# EAGLE design stlink-v3-hwmod (EAGLE 9.5.2)
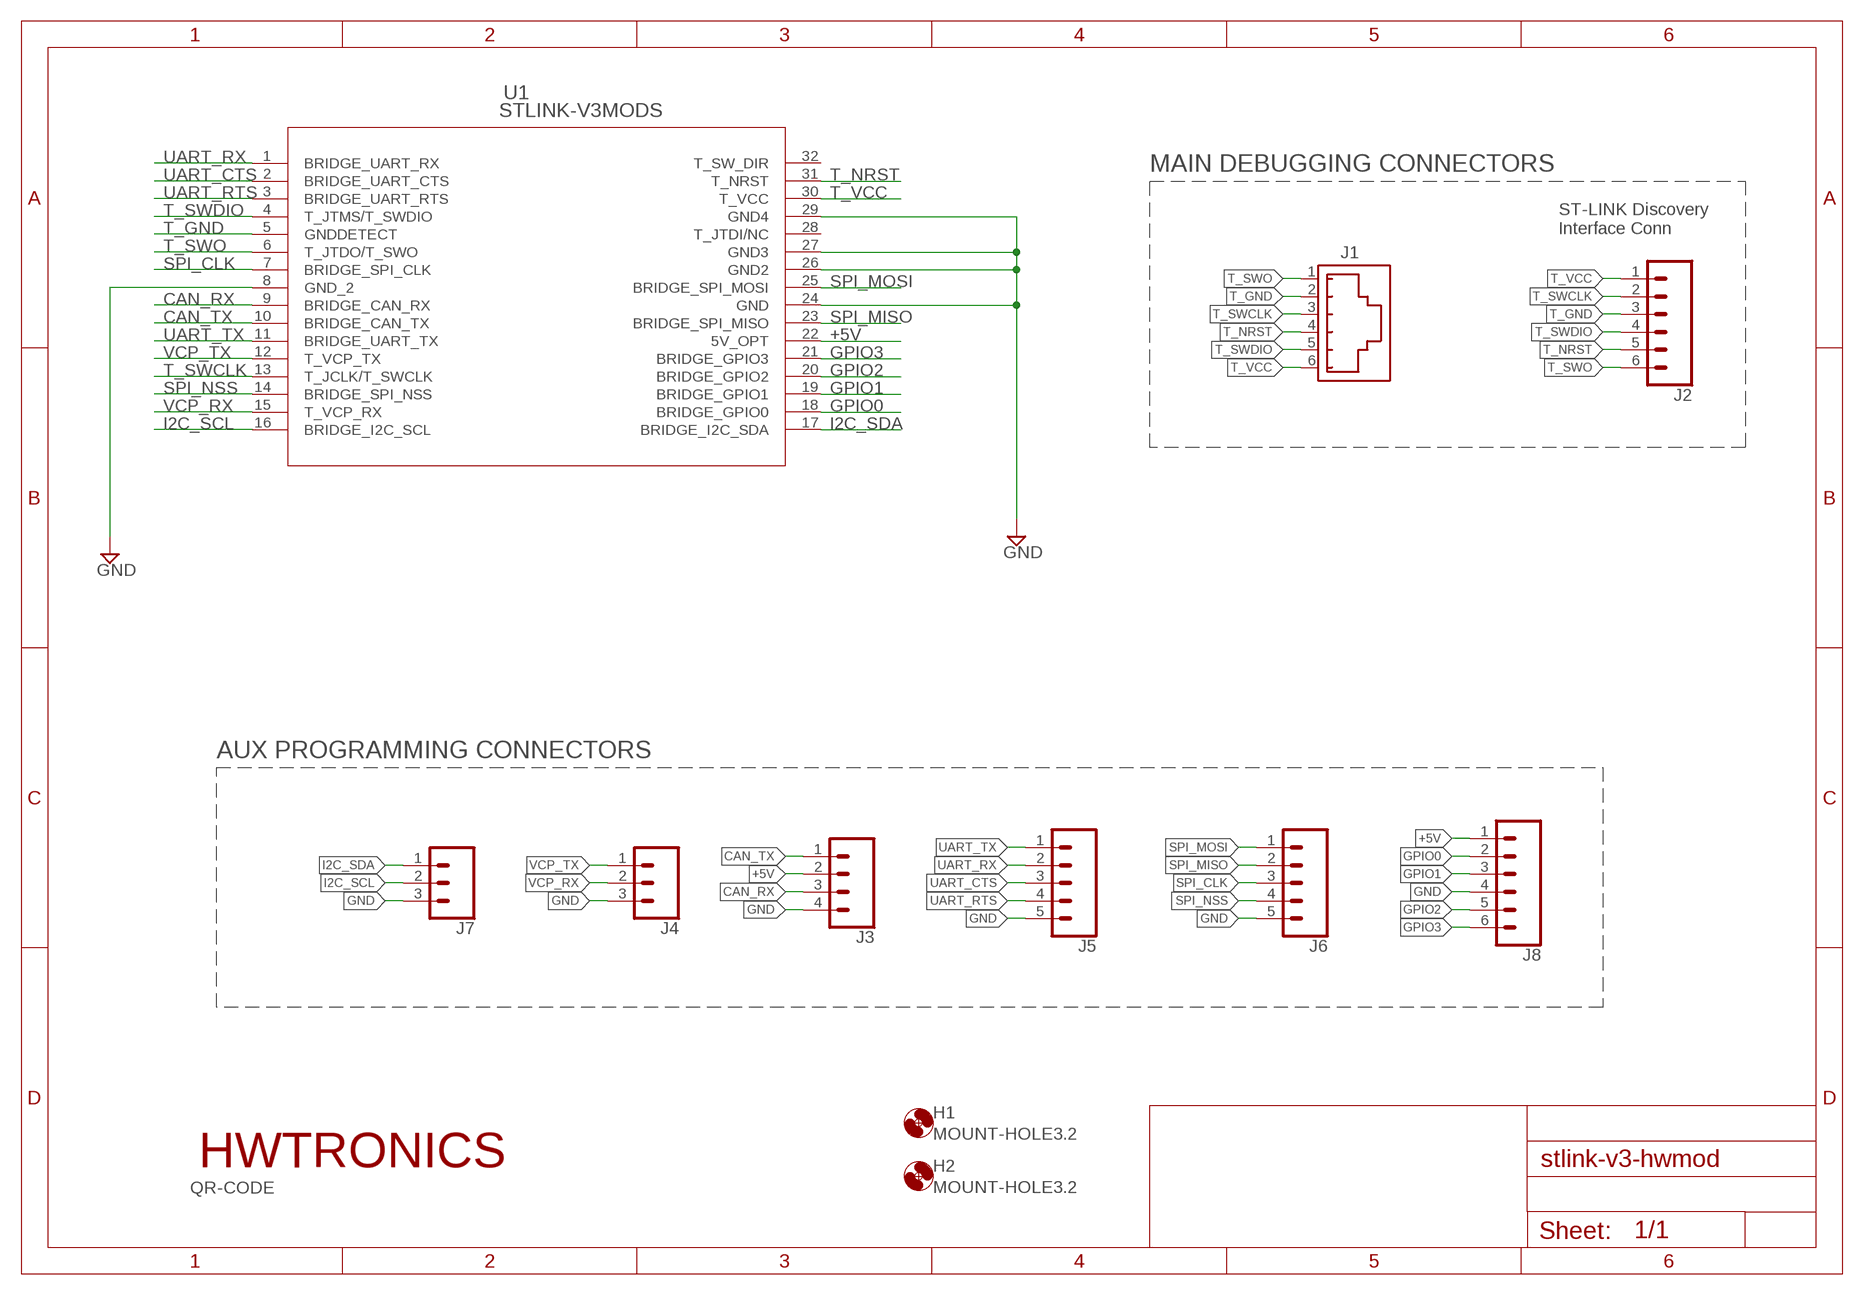
[diagram p0: schematic, sheet 1]

## Parts
H1  MOUNT-HOLE3.2  [3,2]
H2  MOUNT-HOLE3.2  [3,2]
J1  615006143621  [615006143621]
J2  CONN_06SILK_FEMALE_PTH  [1X06]
J3  CONN_04  [1X04]
J4  CONN_03  [1X03]
J5  CONN_05  [1X05]
J6  CONN_05  [1X05]
J7  CONN_03  [1X03]
J8  CONN_06SILK_FEMALE_PTH  [1X06]
LOGO1  LOGO-HWTRONICS-10MM  [HWTRONICS-10MM]
U1  STLINK-V3MODS  [MOD_STLINK-V3M_MB1467]
U$1  STLINK-V3-HWMODS  [STLINK-V3-HWMODS]

## Nets
+5V: J3.2 J8.1 U1.22(5V_OPT)
CAN_RX: J3.3 U1.9(BRIDGE_CAN_RX)
CAN_TX: J3.1 U1.10(BRIDGE_CAN_TX)
GND: J3.4 J4.3 J5.5 J6.5 J7.3 J8.4 U1.8(GND_2) U1.24(GND) U1.26(GND2) U1.27(GND3) U1.29(GND4)
GPIO0: J8.2 U1.18(BRIDGE_GPIO0)
GPIO1: J8.3 U1.19(BRIDGE_GPIO1)
GPIO2: J8.5 U1.20(BRIDGE_GPIO2)
GPIO3: J8.6 U1.21(BRIDGE_GPIO3)
I2C_SCL: J7.2 U1.16(BRIDGE_I2C_SCL)
I2C_SDA: J7.1 U1.17(BRIDGE_I2C_SDA)
SPI_CLK: J6.3 U1.7(BRIDGE_SPI_CLK)
SPI_MISO: J6.2 U1.23(BRIDGE_SPI_MISO)
SPI_MOSI: J6.1 U1.25(BRIDGE_SPI_MOSI)
SPI_NSS: J6.4 U1.14(BRIDGE_SPI_NSS)
T_GND: J1.2 J2.3 U1.5(GNDDETECT)
T_NRST: J1.4 J2.5 U1.31(T_NRST)
T_SWCLK: J1.3 J2.2 U1.13(T_JCLK/T_SWCLK)
T_SWDIO: J1.5 J2.4 U1.4(T_JTMS/T_SWDIO)
T_SWO: J1.1 J2.6 U1.6(T_JTDO/T_SWO)
T_VCC: J1.6 J2.1 U1.30(T_VCC)
UART_CTS: J5.3 U1.2(BRIDGE_UART_CTS)
UART_RTS: J5.4 U1.3(BRIDGE_UART_RTS)
UART_RX: J5.2 U1.1(BRIDGE_UART_RX)
UART_TX: J5.1 U1.11(BRIDGE_UART_TX)
VCP_RX: J4.2 U1.15(T_VCP_RX)
VCP_TX: J4.1 U1.12(T_VCP_TX)
Unconnected: U1.28(T_JTDI/NC) U1.32(T_SW_DIR)

## Notes on the sheet
- MAIN DEBUGGING CONNECTORS
- ST-LINK Discovery
  Interface Conn
- AUX PROGRAMMING CONNECTORS

## Library data of the parts
H1 H2 = holes:MOUNT-HOLE: MOUNTING HOLE with drill center marker
J1 = 615002138421_Eagle_WR-MJ_rev20a:615006143621: WR-MJ Modular Jack Horizontal Plastic 6P6C Tab Down KIND PROPERTIES Quality Class:500 Mating cycles General Information Operating Temperature:-40 up to +85 °C Compliance: RoHS Electrical Properties IR 1:1.5A Working Voltage:120V (AC) Withstanding Voltage:1000V (AC) Contact Resistance:20mΩ RISO:500 MΩ Material Properties Insulator MateriaL:PBT Insulator Flammability Rating:UL94 V-0 Color:Black Contact Material Copper Alloy Contact Plating:Selective Gold Contact Type:Stamped Packaging Properties Packaging:Tray <https://www.we-online.com/catalog/media/o33121v209%20Family_WR-MJ_THT_6P6C_61500X143621.jpg> Details see: https://www.we-online.com/catalog/en/MJ_HORIZONTAL_PLASTIC_6P6C_TAB_DOWN/? Updated by Yingchun,Shan 2020-01-06 2020 (C) Würth Elektronik; DATASHEET-URL: https://www.we-online.com/catalog/datasheet/615006143621.pdf; MOUNT: THT; PART-NUMBER: 615006143621; TYPE: Horizontal; XPXC: 6P6C
J2 J8 = SparkFun-Connectors:CONN_06: Multi connection point. Often used as Generic Header-pin footprint for 0.1 inch spaced/style header connections On any of the 0.1 inch spaced packages, you can populate with these: Break Away Headers - Straight <https://www.sparkfun.com/products/116> (PRT-00116) Break Away Male Headers - Right Angle <https://www.sparkfun.com/products/553> (PRT-00553) Female Headers <https://www.sparkfun.com/products/115> (PRT-00115) Break Away Headers - Machine Pin <https://www.sparkfun.com/products/117> (PRT-00117) Break Away Female Headers - Swiss Machine Pin <https://www.sparkfun.com/products/743> (PRT-00743) Arduino Stackable Header - 6 Pin <https://www.sparkfun.com/products/9280> (PRT-09280) For SCREWTERMINALS and SPRING TERMINALS visit here: Screw Terimnals on SparkFun.com <https://www.sparkfun.com/search/results?term=Screw+Terminals> (5mm/3.5mm/2.54mm spacing) This device is also useful as a general connection point to wire up your design to another part of your project. Our various solder wires solder well into these plated through hole pads. Hook-Up Wire - Assortment (Stranded, 22 AWG) <https://www.sparkfun.com/products/11375> (PRT-11375) Hook-Up Wire - Assortment (Solid Core, 22 AWG) <https://www.sparkfun.com/products/11367> (PRT-11367) View the entire wire category on our website here <https://www.sparkfun.com/categories/141>; PROD_ID: CONN-08437
J3 = SparkFun-Connectors:CONN_04: Multi connection point. Often used as Generic Header-pin footprint for 0.1 inch spaced/style header connections On any of the 0.1 inch spaced packages, you can populate with these: Break Away Headers - Straight <https://www.sparkfun.com/products/116> (PRT-00116) Break Away Male Headers - Right Angle <https://www.sparkfun.com/products/553> (PRT-00553) Female Headers <https://www.sparkfun.com/products/115> (PRT-00115) Break Away Headers - Machine Pin <https://www.sparkfun.com/products/117> (PRT-00117) Break Away Female Headers - Swiss Machine Pin <https://www.sparkfun.com/products/743> (PRT-00743) For SCREWTERMINALS and SPRING TERMINALS visit here: Screw Terimnals on SparkFun.com <https://www.sparkfun.com/search/results?term=Screw+Terminals> (5mm/3.5mm/2.54mm spacing) This device is also useful as a general connection point to wire up your design to another part of your project. Our various solder wires solder well into these plated through hole pads. Hook-Up Wire - Assortment (Stranded, 22 AWG) <https://www.sparkfun.com/products/11375> (PRT-11375) Hook-Up Wire - Assortment (Solid Core, 22 AWG) <https://www.sparkfun.com/products/11367> (PRT-11367) View the entire wire category on our website here <https://www.sparkfun.com/categories/141> Special notes: Molex polarized connector foot print use with SKU : PRT-08231 with associated crimp pins and housings. 1MM SMD Version SKU: PRT-10208; PROD_ID: CONN-09696
J4 J7 = SparkFun-Connectors:CONN_03: Multi connection point. Often used as Generic Header-pin footprint for 0.1 inch spaced/style header connections On any of the 0.1 inch spaced packages, you can populate with these: Break Away Headers - Straight <https://www.sparkfun.com/products/116> (PRT-00116) Break Away Male Headers - Right Angle <https://www.sparkfun.com/products/553> (PRT-00553) Female Headers <https://www.sparkfun.com/products/115> (PRT-00115) Break Away Headers - Machine Pin <https://www.sparkfun.com/products/117> (PRT-00117) Break Away Female Headers - Swiss Machine Pin <https://www.sparkfun.com/products/743> (PRT-00743) Stackable Header - 3 Pin (Female, 0.1") <https://www.sparkfun.com/products/13875> (PRT-13875) For SCREWTERMINALS and SPRING TERMINALS visit here: Screw Terimnals on SparkFun.com <https://www.sparkfun.com/search/results?term=Screw+Terminals> (5mm/3.5mm/2.54mm spacing) This device is also useful as a general connection point to wire up your design to another part of your project. Our various solder wires solder well into these plated through hole pads. Hook-Up Wire - Assortment (Stranded, 22 AWG) <https://www.sparkfun.com/products/11375> (PRT-11375) Hook-Up Wire - Assortment (Solid Core, 22 AWG) <https://www.sparkfun.com/products/11367> (PRT-11367) View the entire wire category on our website here <https://www.sparkfun.com/categories/141> Special notes: Molex polarized connector foot print use with SKU : PRT-08232 with associated crimp pins and housings.
J5 J6 = SparkFun-Connectors:CONN_05: Multi connection point. Often used as Generic Header-pin footprint for 0.1 inch spaced/style header connections On any of the 0.1 inch spaced packages, you can populate with these: Break Away Headers - Straight <https://www.sparkfun.com/products/116> (PRT-00116) Break Away Male Headers - Right Angle <https://www.sparkfun.com/products/553> (PRT-00553) Female Headers <https://www.sparkfun.com/products/115> (PRT-00115) Break Away Headers - Machine Pin <https://www.sparkfun.com/products/117> (PRT-00117) Break Away Female Headers - Swiss Machine Pin <https://www.sparkfun.com/products/743> (PRT-00743) For SCREWTERMINALS and SPRING TERMINALS visit here: Screw Terimnals on SparkFun.com <https://www.sparkfun.com/search/results?term=Screw+Terminals> (5mm/3.5mm/2.54mm spacing) This device is also useful as a general connection point to wire up your design to another part of your project. Our various solder wires solder well into these plated through hole pads. Hook-Up Wire - Assortment (Stranded, 22 AWG) <https://www.sparkfun.com/products/11375> (PRT-11375) Hook-Up Wire - Assortment (Solid Core, 22 AWG) <https://www.sparkfun.com/products/11367> (PRT-11367) View the entire wire category on our website here <https://www.sparkfun.com/categories/141> Special notes: Molex polarized connector foot print use with SKU : PRT-08231 with associated crimp pins and housings. 1MM SMD Version SKU: PRT-10208
LOGO1 = Logo-hwtronics:LOGO-HWTRONICS
U1 = STLINK-V3MODS:STLINK-V3MODS; MANUFACTURER_PART_NUMBER: STLINKV3MOS; VENDOR: STMicroelectronics
U$1 = Logo-hwtronics:STLINK-V3-HWMODS

## Board
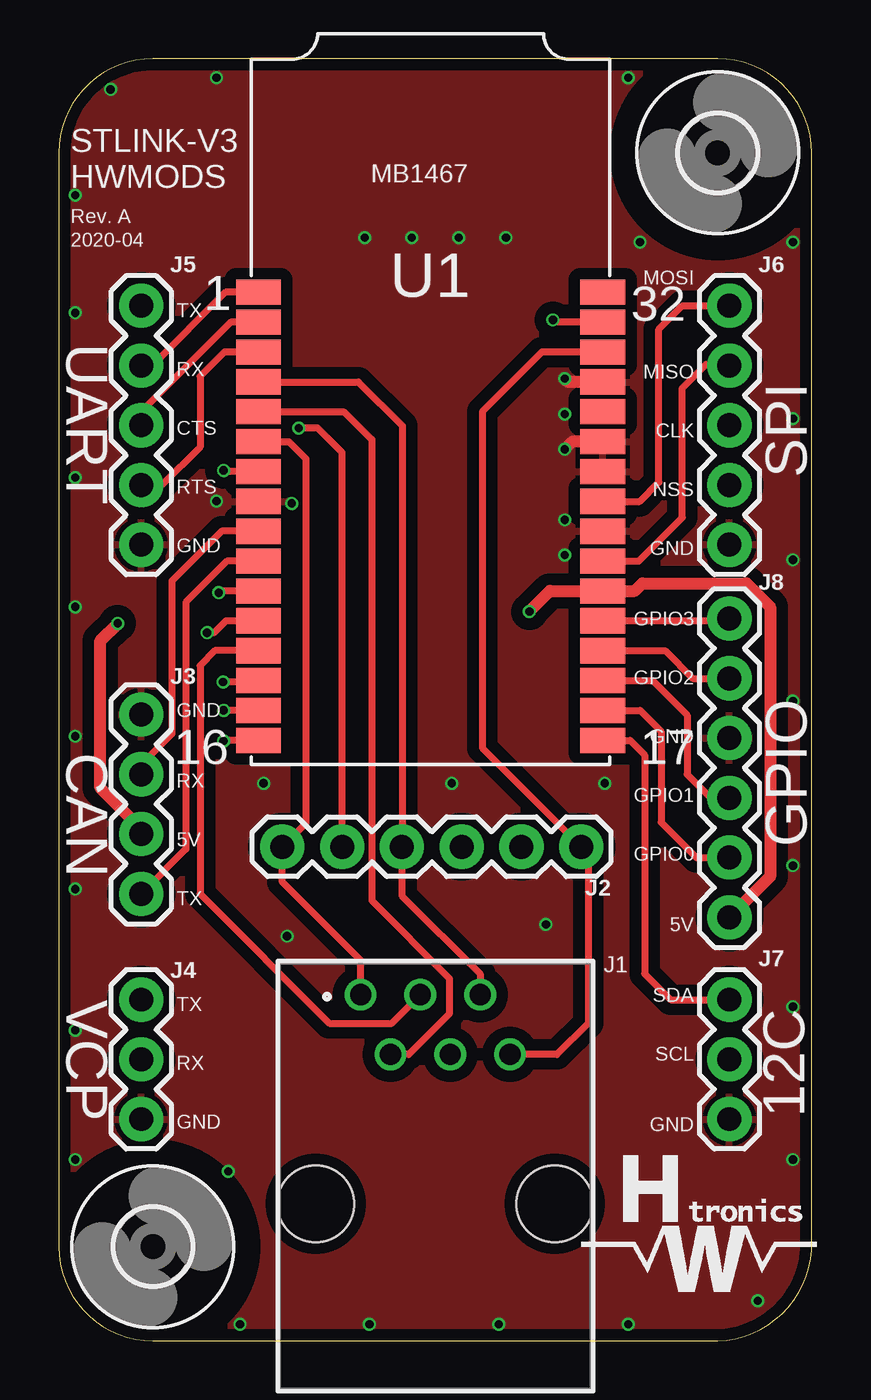
[diagram p1: board, top side]
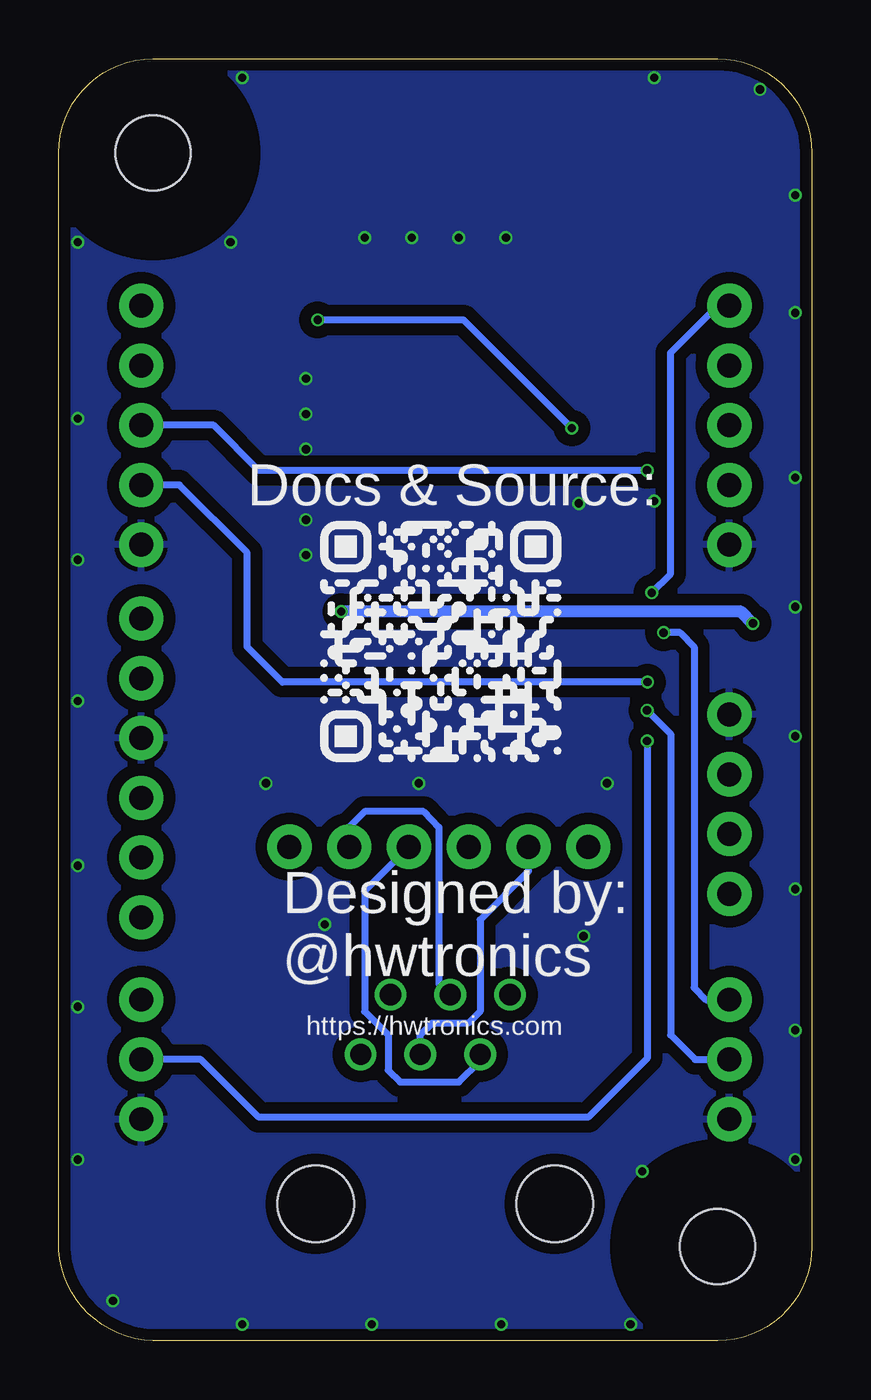
[diagram p2: board, bottom side, seen from below]

Size 32 x 54.5 mm. Coordinates in mm from the lower left corner, seen from the top.
Outline: 0,50.5 0,4 arc90 4,0 28,0 arc90 32,4.23 32,50.5 arc90 28,54.5 4,54.5 arc90 0,50.5
Copper layers (1*16): Top 0.018mm / dielectric 1.55mm / Bottom 0.018mm
Design rules "ALLPCB": minimum track width 0.3mm, minimum drill 0.3mm, track to track 0.16mm, track to pad 0.16mm, pad to pad 0.16mm, via to via 0.16mm, smd to smd 0mil, copper to edge 0.2mm, drill to drill 0.2mm, minimum pad ring 0.125mm, minimum via ring 0.1mm, stop-mask expansion 2mil, vias tented up to drill 0.45mm, thermal gap 0.2mm

### Footprints (pad centres in the part's own frame; a part is rotated, then mirrored left to right if it is on the bottom)
3,2 = hole 3.2: 0,0
615006143621 = drill 0.9: 1 -3.175,7.71; 2 -1.905,5.17; 3 -0.635,7.71; 4 0.635,5.17; 5 1.905,7.71; 6 3.175,5.17 | hole 3.25: -5.08,-1.18; 5.08,-1.18
1X06 = drill 1.016 pad 1.88: 1 0,0; 2 2.54,0; 3 5.08,0; 4 7.62,0; 5 10.16,0; 6 12.7,0
1X04 = drill 1.016 pad 1.88: 1 0,0; 2 2.54,0; 3 5.08,0; 4 7.62,0
1X03 = drill 1.016 pad 1.88: 1 0,0; 2 2.54,0; 3 5.08,0
1X05 = drill 1.016 pad 1.88: 1 0,0; 2 2.54,0; 3 5.08,0; 4 7.62,0; 5 10.16,0
MOD_STLINK-V3M_MB1467 = smd 1.9 x 1.07: 1 -7.32,-9.906; 2 -7.32,-11.176; 3 -7.32,-12.446; 4 -7.32,-13.716; 5 -7.32,-14.986; 6 -7.32,-16.256; 7 -7.32,-17.526; 8 -7.32,-18.796; 9 -7.32,-20.066; 10 -7.32,-21.336; 11 -7.32,-22.606; 12 -7.32,-23.876; 13 -7.32,-25.146; 14 -7.32,-26.416; 15 -7.32,-27.686; 16 -7.32,-28.956; 17 7.32,-28.956; 18 7.32,-27.686; 19 7.32,-26.416; 20 7.32,-25.146; 21 7.32,-23.876; 22 7.32,-22.606; 23 7.32,-21.336; 24 7.32,-20.066; 25 7.32,-18.796; 26 7.32,-17.526; 27 7.32,-16.256; 28 7.32,-14.986; 29 7.32,-13.716; 30 7.32,-12.446; 31 7.32,-11.176; 32 7.32,-9.906

### Placement (x,y rotation side)
H1  4,4 0 top
H2  28,50.5 0 top
J1  16,7 0 top
J2  22.2,21 180 top
J3  3.5,19 90 top
J4  3.5,14.5 270 top
J5  3.5,44 270 top
J6  28.5,44 270 top
J7  28.5,14.5 270 top
J8  28.5,18 90 top
LOGO1  25,2 0 top
U1  15.8,54.48 0 top
U$1  21.5,24 0 bottom

### Tracks (layer width: path | path; a pad name or v marks a point on that pad's centre or on a via)
+5V  (via drill 0.35)
  Top 0.5: J3.2 3.5,21.77 1.77,23.5 1.77,29.77 v2.5,30.5 | v20,31 20.87,31.87 U1.22 24.47,31.87 24.8,32.2 29.23,32.2 30.23,31.2 30.23,19.73 J8.1
  Bottom 0.5: v2.5,30.5 3,31 v20,31
CAN_RX
  Top 0.3: U1.9 6.91,34.41 4.8,32.3 4.8,25.8 3.5,24.5 J3.3
CAN_TX
  Top 0.3: U1.10 7.14,33.14 5.4,31.4 5.4,20.9 J3.1
GND  (via drill 0.35)
  Top 0.5: U1.29 21.64,40.76 v21.5,40.9 | U1.27 21.82,38.22 v21.5,37.9
  other vias: 6.7,35.7 9.9,35.6 21.5,33.4 6.7,53.7 2.2,53.2 0.7,48.7 0.7,43.7 0.7,36.7 0.7,31.2 0.7,25.7 0.7,19.2 0.7,13.2 0.7,7.7 7.7,0.7 13.2,0.7 18.7,0.7 24.2,0.7 29.7,1.7 31.2,7.7 31.2,14.2 31.2,20.2 31.2,27.2 31.2,33.2 31.2,39.2 31.2,46.7 24.7,46.7 24.2,53.7 7.2,7.2 9.7,17.2 8.7,23.7 20.7,17.7 16.7,23.7 21.5,34.9 21.5,39.4 13,46.9 15,46.9 17,46.9 19,46.9 23.2,23.7
  pour Bottom (isolate 0.5): -0.5,55.5 32.5,55.5 32.5,-0.5 -0.5,-0.5
  pour Top (isolate 0.5): -1,56 -1,-1 33,-1 33,56
GPIO0
  Top 0.3: U1.18 24.71,26.79 25.6,25.9 25.6,22.04 27.1,20.54 J8.2
GPIO1
  Top 0.3: U1.19 25.24,28.06 26.7,26.6 26.7,24.08 27.7,23.08 J8.3
GPIO2
  Top 0.3: U1.20 25.77,29.33 26.94,28.16 J8.5
GPIO3
  Top 0.3: J8.6 28.4,30.6 U1.21
I2C_SCL  (via drill 0.35)
  Top 0.3: U1.16 7.02,25.52 v7,25.5
  Bottom 0.3: v7,25.5 7,12 9.5,9.5 23.5,9.5 25.96,11.96 J7.2
I2C_SDA
  Top 0.3: U1.17 24.28,25.52 24.9,24.9 24.9,15.6 26,14.5 J7.1
SPI_CLK  (via drill 0.35)
  Top 0.3: U1.7 7.05,36.95 v7,37
  Bottom 0.3: v7,37 23.5,37 25.42,38.92 J6.3
SPI_MISO
  Top 0.3: U1.23 24.64,33.14 26.5,35 26.5,40.5 27.5,41.5 28.46,41.5 J6.2
SPI_MOSI
  Top 0.3: U1.25 24.68,35.68 25.5,36.5 25.5,43 26.5,44 J6.1
SPI_NSS  (via drill 0.35)
  Top 0.3: U1.14 8.42,28 v6.98,28
  Bottom 0.3: J6.4 26.88,36.38 24,33.5 24,29.5 22.5,28 v6.98,28
T_GND
  Top 0.3: U1.5 12.11,39.49 13.3,38.32 13.3,18.72 16.6,15.4 16.6,13.9 14.87,12.17 J1.2
  Bottom 0.3: J2.3 19,19.12 19,14 18,13 18,11.5 17.5,11 15,11 14.1,11.9 J1.2
T_NRST  (via drill 0.35)
  Top 0.3: J2.5 12.04,37.76 11,38.8 v10.2,38.8 | U1.31 21.1,43.3 v21,43.4
  Bottom 0.3: J2.5 12.04,19.96 14.1,17.9 14.1,14 14.6,13.5 16.14,13.5 16.64,13 J1.4 | v10.2,38.8 14.8,43.4 v21,43.4
T_SWCLK
  Top 0.3: U1.13 6.63,29.33 6,28.7 6,19 11.5,13.5 14.15,13.5 J1.3
  Bottom 0.3: J2.2 19.66,21.84 19,22.5 16.5,22.5 15.85,21.82 15.85,15.17 J1.3
T_SWDIO
  Top 0.3: U1.4 12.74,40.76 14.6,38.9 14.6,21.12 14.58,21.1 J2.4 14.58,18.92 17.91,15.6 J1.5
T_SWO
  Top 0.3: U1.6 9.78,38.22 10.5,37.5 10.5,22 J2.6 9.5,19.5 12.84,16.16 J1.1
T_VCC
  Top 0.3: U1.30 20.53,42.03 18,39.5 18,25.2 J2.1 22.5,20.7 22.5,13.5 21.17,12.17 J1.6
UART_CTS
  Top 0.3: U1.2 7.3,43.3 3.5,39.5 J5.3
UART_RTS
  Top 0.3: U1.3 7.03,42.03 6,41 6,38 4.38,36.38 J5.4
UART_RX
  Top 0.3: U1.1 7.07,44.57 3.96,41.46 J5.2
UART_TX  (via drill 0.35)
  Top 0.3: U1.11 6.87,31.87 v6.8,31.8
  Bottom 0.3: v6.8,31.8 6,32.6 6,42 4,44 J5.1
VCP_RX  (via drill 0.35)
  Top 0.3: U1.15 v7.01,26.79 v7,26.8
  Bottom 0.3: v7,26.8 6,25.8 6,13 4.96,11.96 J4.2
VCP_TX  (via drill 0.35)
  Top 0.3: U1.12 7.1,30.6 6.6,30.1 v6.3,30.1
  Bottom 0.3: v6.3,30.1 5.6,30.1 5,29.5 5,15 4.5,14.5 J4.1

### Text on the board
tPlace: STLINK-V3 / HWMODS | Rev. A | 2020-04 | MOSI | TX | UART | MISO | RX | CLK | CTS | SPI | RTS | NSS | GND | GND | GPIO3 | GPIO2 | GND | GND | CAN | RX | GPIO1 | 5V | GPIO0 | GPIO | TX | 5V | SDA | VCP | TX | RX | SCL | GND | 12C | GND
bPlace: Docs & Source: | Designed by: / @hwtronics | https://hwtronics.com